# EAGLE design C64_Userport_Test (EAGLE 9.6.2)
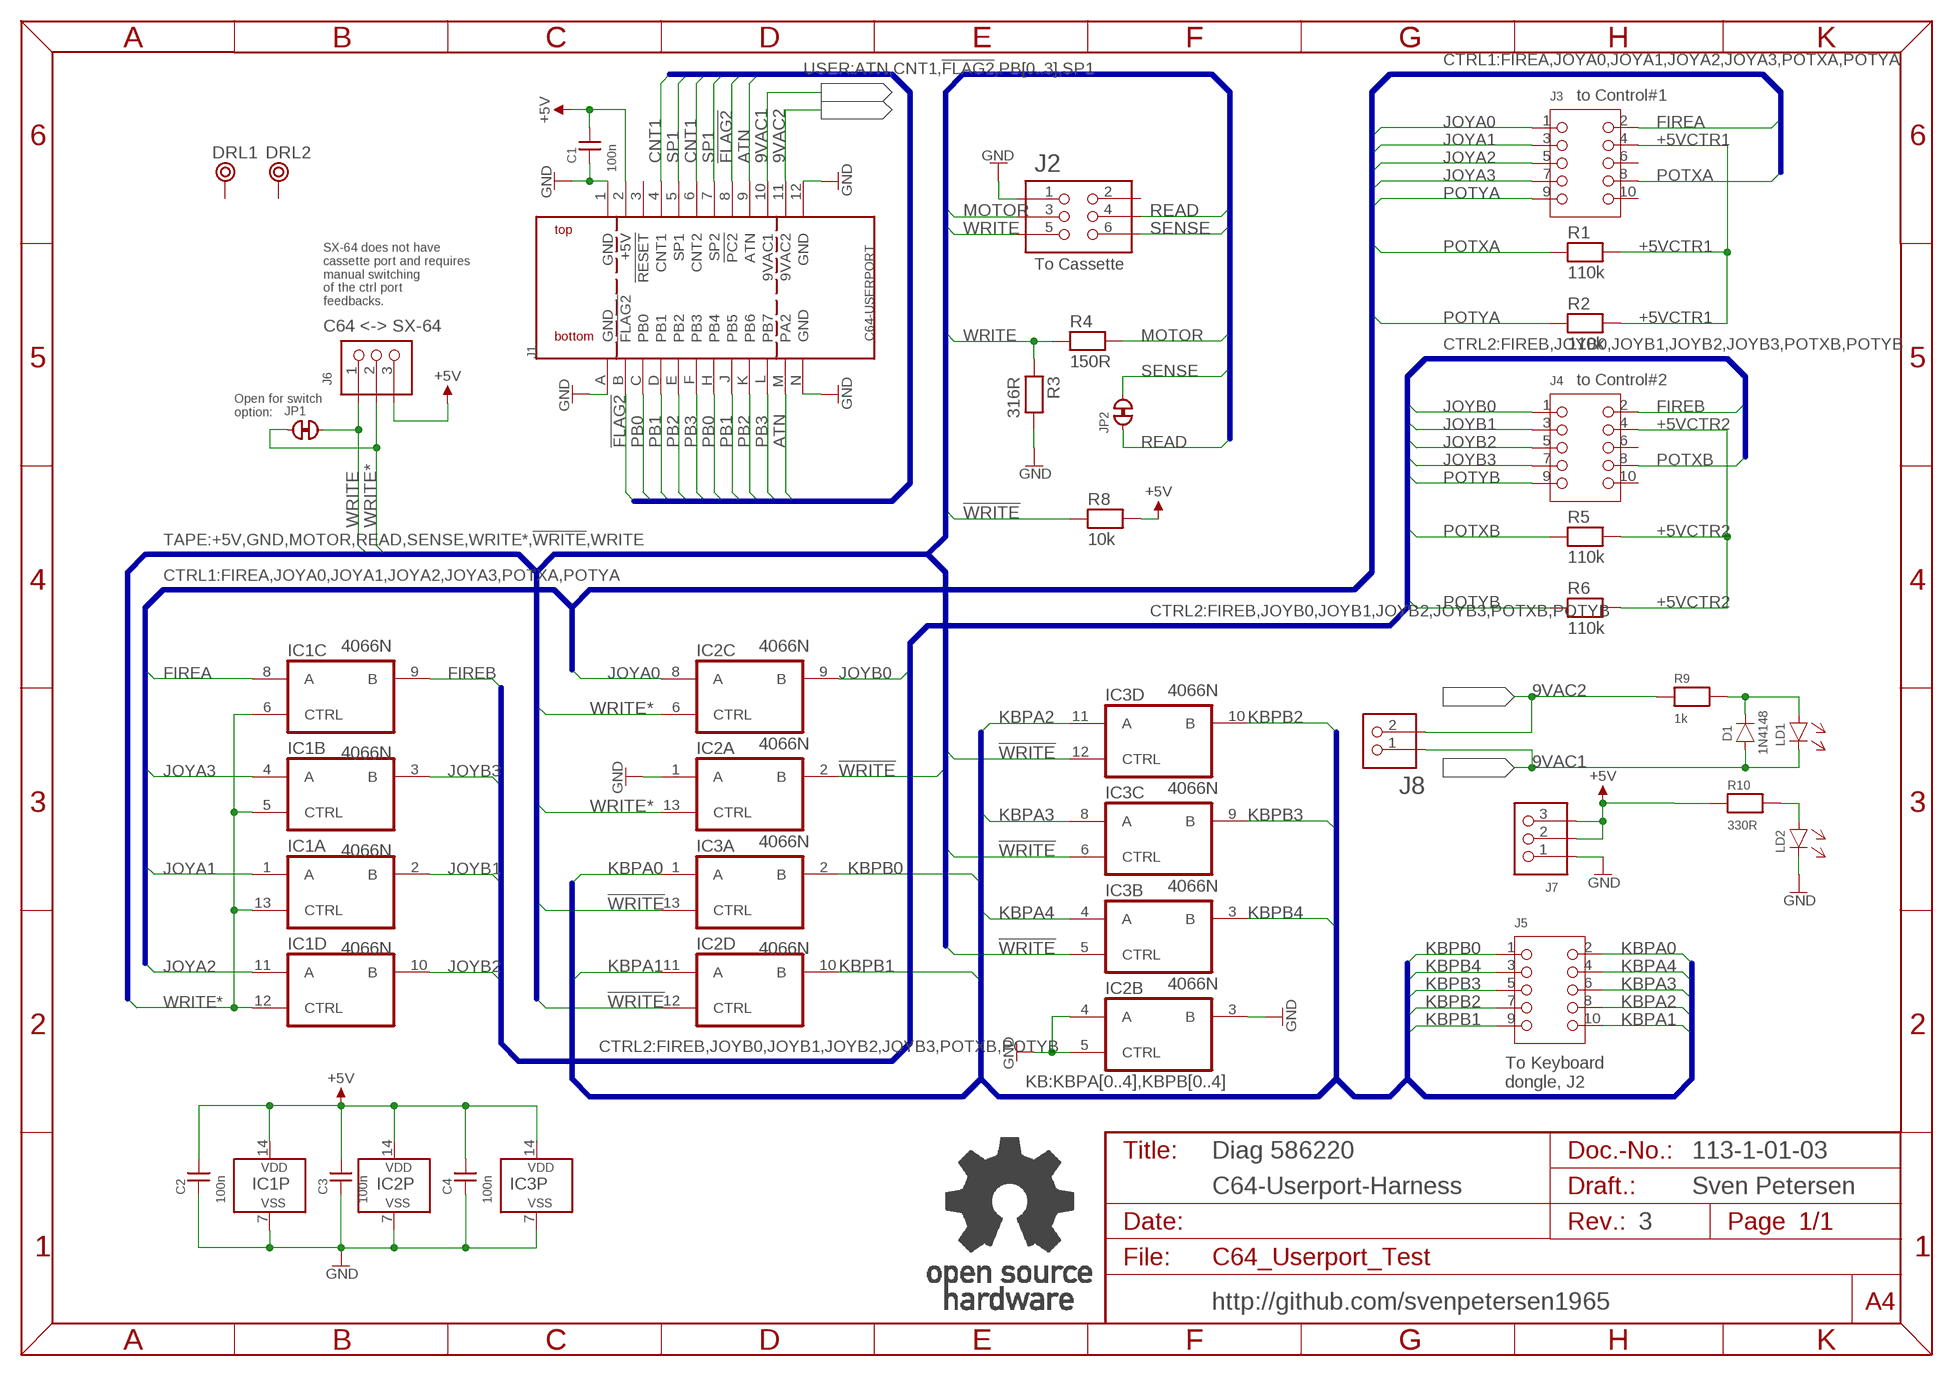
[diagram p0: schematic, sheet 1]

## Parts
C1  100n  CAP01  [C-2,5]
C2  100n  CAP01  [C-2,5]
C3  100n  CAP01  [C-2,5]
C4  100n  CAP01  [C-2,5]
D1  1N4148  [DO-35]
DRL1  BOHR3,2  [BOHR3,2]
DRL2  BOHR3,2  [BOHR3,2]
IC1  4066N  [DIL14]
IC2  4066N  [DIL14]
IC3  4066N  [DIL14]
J1  C64-USERPORT  [USERPORT]
J2  2X03WV  [2X03WV]
J3  2X05WV  [2X05WV]
J4  2X05WV  [2X05WV]
J5  2X05WV  [2X05WV]
J6  PINHD-1X3  [1X03]
J7  PINHD-1X3  [1X03]
J8  PINHD-1X2  [1X02]
JP1  CLOSED  [CP_CL]
JP2  CLOSED  [CP_CL]
LD1  3MM  [3MM]
LD2  3MM  [3MM]
R1  110k  RES04  [R-10]
R2  110k  RES04  [R-10]
R3  316R  RES04  [R-10]
R4  150R  RES04  [R-10]
R5  110k  RES04  [R-10]
R6  110k  RES04  [R-10]
R8  10k  RES04  [R-10]
R9  1k  RES04  [R-10]
R10  330R  RES04  [R-10]
U$20  OPEN_SOURCE_HW  [OPENHW]

## Nets
9VAC1: D1.A J1.10(9VAC1) J8.1 LD1.C(K)
9VAC2: J1.11(9VAC2) J8.2 R9.1
!FLAG2: J1.8(!PC2) J1.B(!FLAG2)
!WRITE: IC2.2(A:B) IC2.12(D:CTRL) IC3.5(B:CTRL) IC3.6(C:CTRL) IC3.12(D:CTRL) IC3.13(A:CTRL) R8.1
+5V: C1.2 C2.2 C3.2 C4.2 IC1.14(P:VDD) IC2.14(P:VDD) IC3.14(P:VDD) J1.2(+5V) J6.3 J7.2 J7.3 R8.2 R10.1
+5VCTR1: J3.4 R1.2 R2.2
+5VCTR2: J4.4 R5.2 R6.2
ATN: J1.9(ATN) J1.M(PA2)
CNT1: J1.4(CNT1) J1.6(CNT2)
FIREA: IC1.8(C:A) J3.2
FIREB: IC1.9(C:B) J4.2
GND: C1.1 C2.1 C3.1 C4.1 IC1.7(P:VSS) IC2.1(A:A) IC2.3(B:B) IC2.4(B:A) IC2.5(B:CTRL) IC2.7(P:VSS) IC3.7(P:VSS) J1.1(GND) J1.12(GND) J1.A(GND) J1.N(GND) J2.1 J7.1 LD2.C(K) R3.2
JOYA0: IC2.8(C:A) J3.1
JOYA1: IC1.1(A:A) J3.3
JOYA2: IC1.11(D:A) J3.5
JOYA3: IC1.4(B:A) J3.7
JOYB0: IC2.9(C:B) J4.1
JOYB1: IC1.2(A:B) J4.3
JOYB2: IC1.10(D:B) J4.5
JOYB3: IC1.3(B:B) J4.7
KBPA0: IC3.1(A:A) J5.2
KBPA1: IC2.11(D:A) J5.10
KBPA2: IC3.11(D:A) J5.8
KBPA3: IC3.8(C:A) J5.6
KBPA4: IC3.4(B:A) J5.4
KBPB0: IC3.2(A:B) J5.1
KBPB1: IC2.10(D:B) J5.9
KBPB2: IC3.10(D:B) J5.7
KBPB3: IC3.9(C:B) J5.5
KBPB4: IC3.3(B:B) J5.3
MOTOR: J2.3 R4.2
N$1: D1.K LD1.A R9.2
N$3: LD2.A R10.2
PB0: J1.C(PB0) J1.H(PB4)
PB1: J1.D(PB1) J1.J(PB5)
PB2: J1.E(PB2) J1.K(PB6)
PB3: J1.F(PB3) J1.L(PB7)
POTXA: J3.8 R1.1
POTXB: J4.8 R5.1
POTYA: J3.9 R2.1
POTYB: J4.9 R6.1
READ: J2.4 JP2.1
SENSE: J2.6 JP2.2
SP1: J1.5(SP1) J1.7(SP2)
WRITE: J2.5 J6.1 JP1.2 R3.1 R4.1
WRITE*: IC1.5(B:CTRL) IC1.6(C:CTRL) IC1.12(D:CTRL) IC1.13(A:CTRL) IC2.6(C:CTRL) IC2.13(A:CTRL) J6.2 JP1.1
Unconnected: DRL1.P$1 DRL2.P$1 J1.3(!RESET) J2.2 J3.6 J3.10 J4.6 J4.10

## Buses
USER:ATN,CNT1,!FLAG2,PB[0..3],SP1
TAPE:+5V,GND,MOTOR,READ,SENSE,WRITE*,!WRITE,WRITE
CTRL1:FIREA,JOYA0,JOYA1,JOYA2,JOYA3,POTXA,POTYA
CTRL2:FIREB,JOYB0,JOYB1,JOYB2,JOYB3,POTXB,POTYB
KB:KBPA[0..4],KBPB[0..4]

## Notes on the sheet
- to Control#1
- To Cassette
- SX-64 does not have
  cassette port and requires
  manual switching
  of the ctrl port
  feedbacks.
- C64 <-> SX-64
- to Control#2
- Open for switch
  option:
- To Keyboard
  dongle, J2
- Diag 586220 | 113-1-01-03
- C64-Userport-Harness | Sven Petersen
- 3
- http://github.com/svenpetersen1965

## Library data of the parts
C1-C4 = DISCRETE:CAP01
D1 = Dioden:1N4148
DRL1 DRL2 = Mech_Bohr:BOHR3,2
IC1-IC3 = 40xx:4066: Quad bilateral ANALOG SWITCH
J1 = Commodore:C64-USERPORT
J2 = PINHEAD:2X03WV
J3-J5 = PINHEAD:2X05WV
J6 J7 = PINHEAD:PINHD-1X3
J8 = PINHEAD:PINHD-1X2
JP1 JP2 = Cutpad:CLOSED: Closed Cutpad
LD1 LD2 = LED:3MM
R1-R6 R8-R10 = DISCRETE:RES04
U$20 = Logo:OPEN_SOURCE_HW

## Board
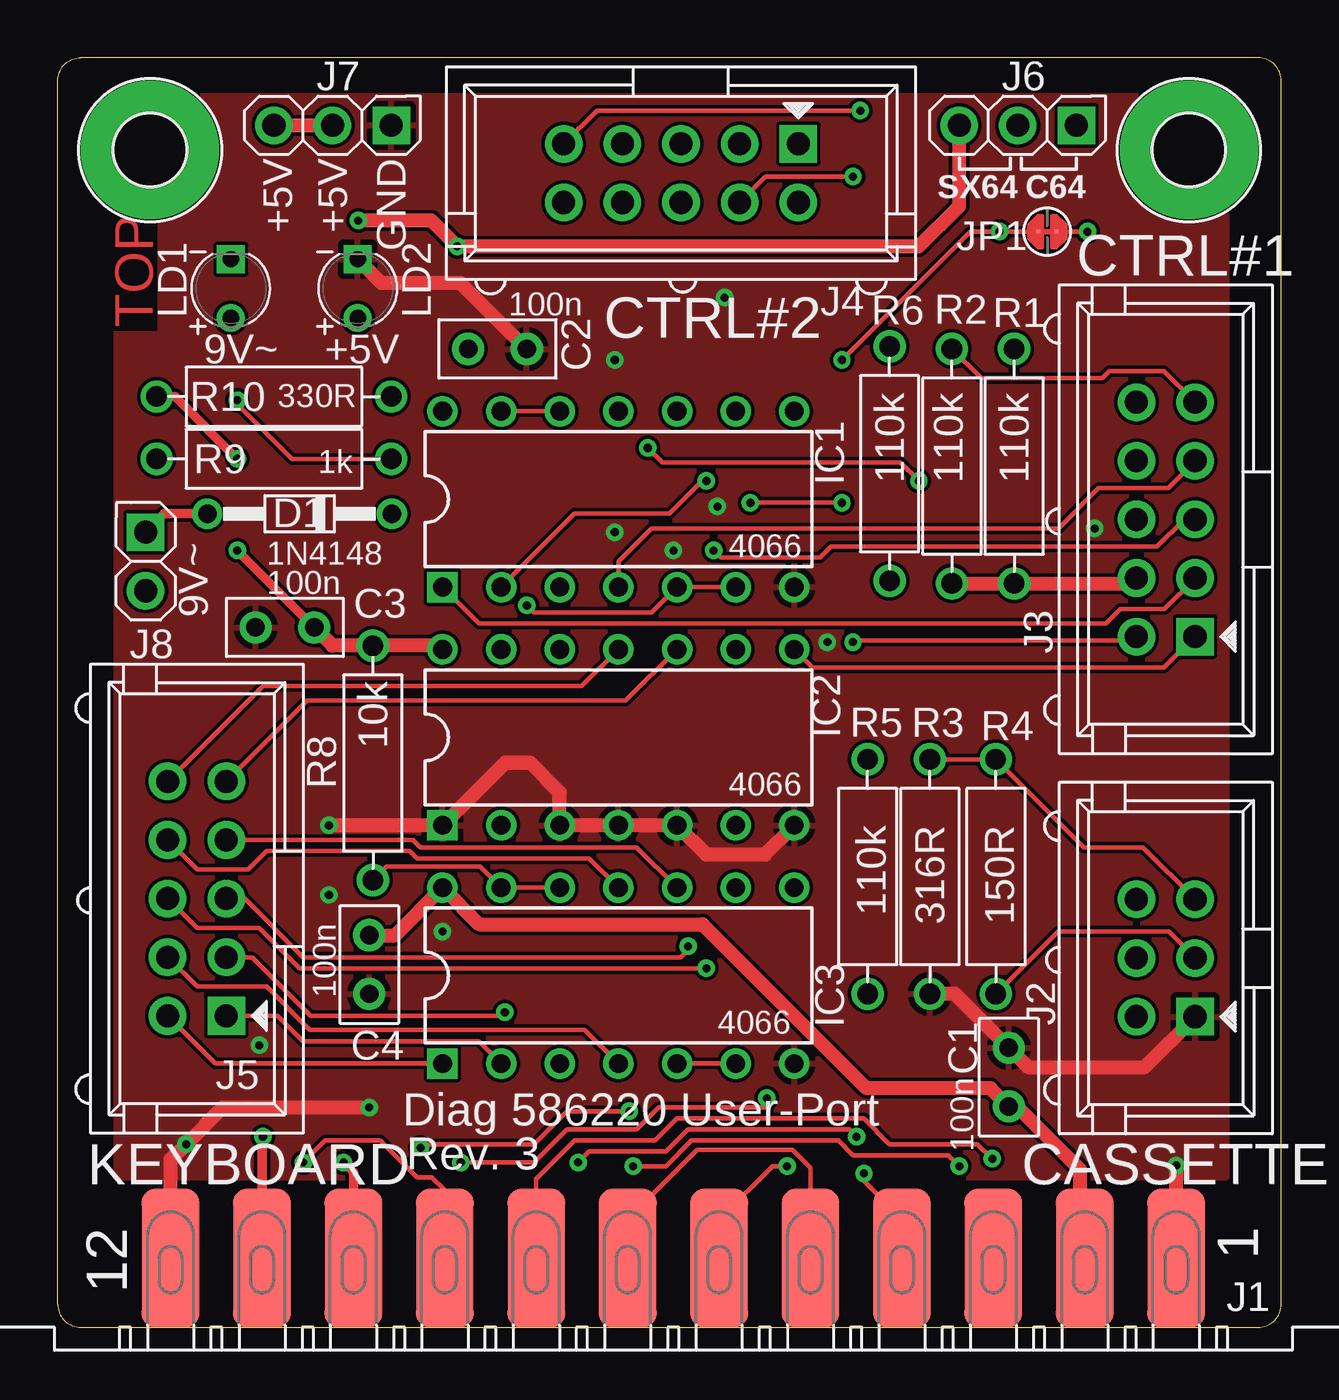
[diagram p1: board, top side]
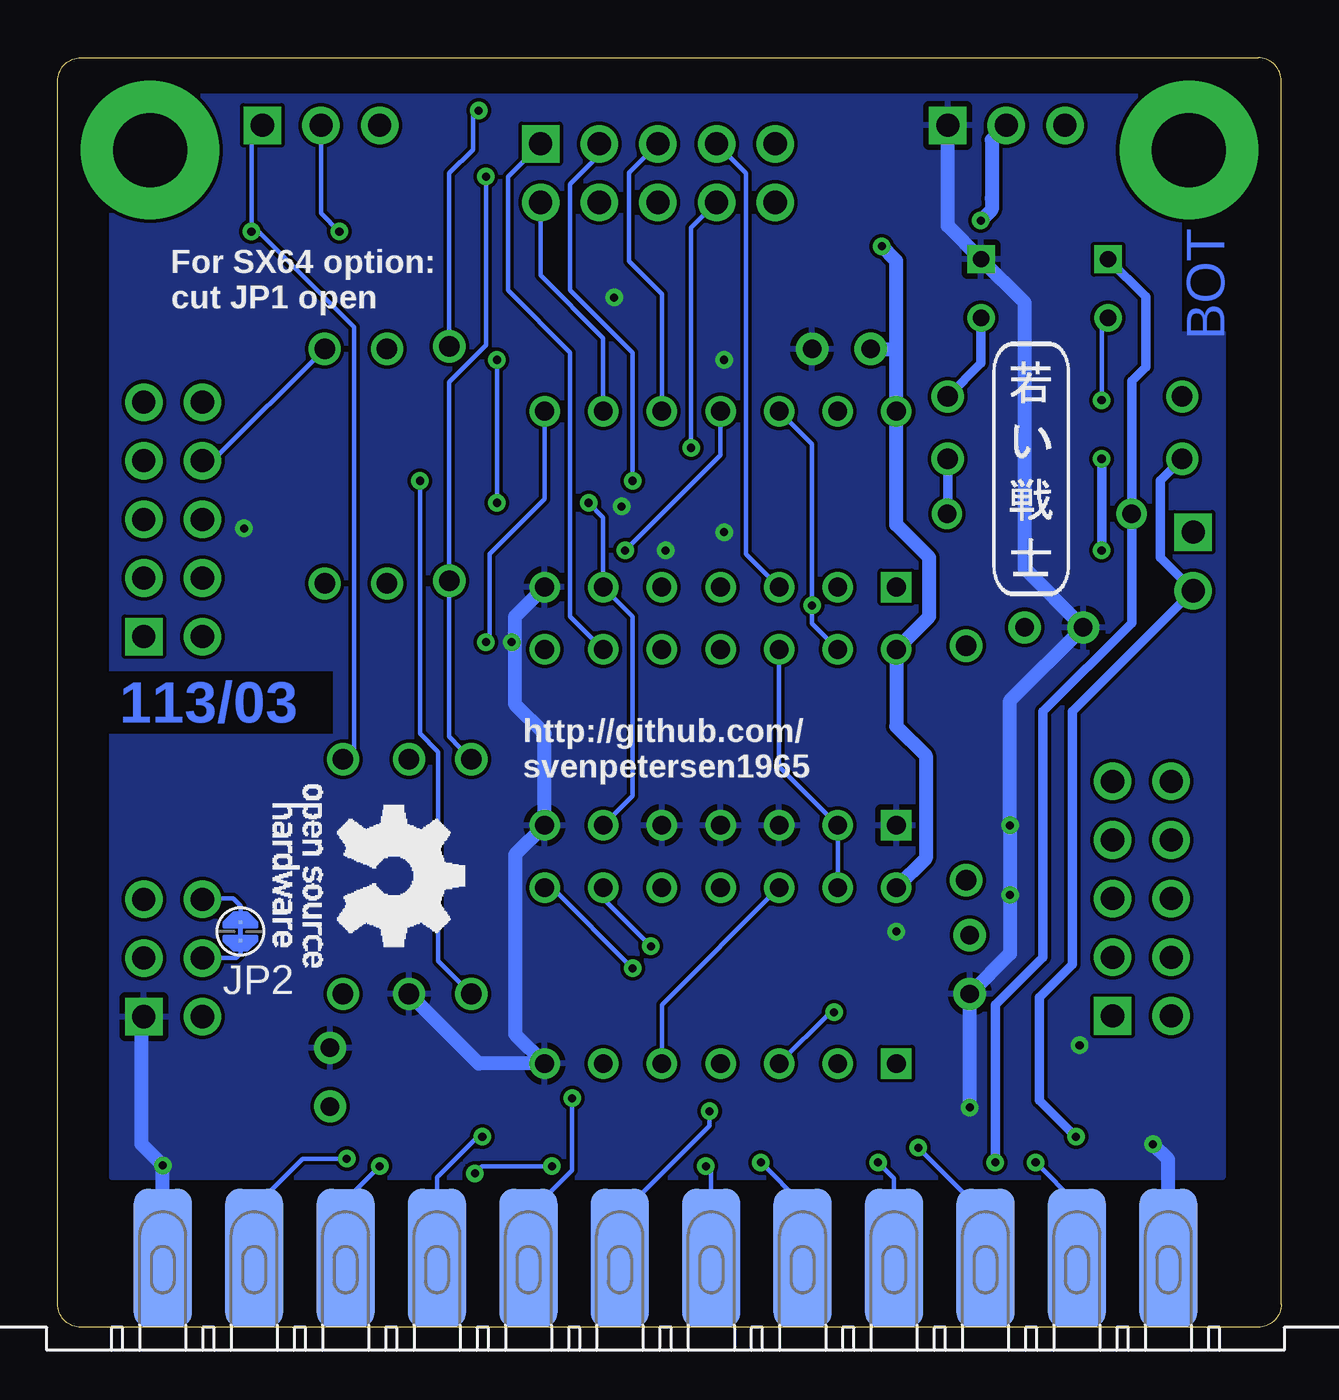
[diagram p2: board, bottom side, seen from below]

Size 53 x 55 mm. Coordinates in mm from the lower left corner, seen from the top.
Outline: 0,1 0,54 arc-90 1,55 52,55 arc-90 53,54 53,1 arc-90 52,0 1,0 arc-90 0,1
Copper layers (1*16): Top 0.035mm / dielectric 1.5mm / Bottom 0.035mm
Design rules "default *": minimum track width 6mil, minimum drill 0.35mm, track to track 6mil, track to pad 6mil, pad to pad 6mil, via to via 6mil, smd to smd 6mil, copper to edge 40mil, drill to drill 6mil, minimum pad ring 10mil, minimum via ring 8mil, stop-mask expansion 4mil, vias tented up to drill 24mil, thermal gap 10mil
bRestrict: 3 lines

### Footprints (pad centres in the part's own frame; a part is rotated, then mirrored left to right if it is on the bottom)
C-2,5 = drill 0.8 pad 1.397: 1 -1.27,0; 2 1.27,0
DO-35 = drill 0.8: A -4,0; K 4,0
BOHR3,2 = drill 3.2 pad 6: P$1 0,0
DIL14 = drill 0.813 square: 1 -7.62,-3.81 | drill 0.813: 2 -5.08,-3.81; 3 -2.54,-3.81; 4 0,-3.81; 5 2.54,-3.81; 6 5.08,-3.81; 7 7.62,-3.81; 8 7.62,3.81; 9 5.08,3.81; 10 2.54,3.81; 11 0,3.81; 12 -2.54,3.81; 13 -5.08,3.81; 14 -7.62,3.81
USERPORT = smd 2.5 x 6: 1 -21.78,-3; 2 -17.82,-3; 3 -13.86,-3; 4 -9.9,-3; 5 -5.94,-3; 6 -1.98,-3; 7 1.98,-3; 8 5.94,-3; 9 9.9,-3; 10 13.86,-3; 11 17.82,-3; 12 21.78,-3 | smd 2.5 x 6 bottom: A -21.78,-3; B -17.82,-3; C -13.86,-3; D -9.9,-3; E -5.94,-3; F -1.98,-3; H 1.98,-3; J 5.94,-3; K 9.9,-3; L 13.86,-3; M 17.82,-3; N 21.78,-3
2X03WV = drill 1 pad 1.626 square: 1 -2.54,-1.27 | drill 1 pad 1.626: 2 -2.54,1.27; 3 0,-1.27; 4 0,1.27; 5 2.54,-1.27; 6 2.54,1.27
2X05WV = drill 1 pad 1.626 square: 1 -5.08,-1.27 | drill 1 pad 1.626: 2 -5.08,1.27; 3 -2.54,-1.27; 4 -2.54,1.27; 5 0,-1.27; 6 0,1.27; 7 2.54,-1.27; 8 2.54,1.27; 9 5.08,-1.27; 10 5.08,1.27
1X03 = drill 1 pad 1.626 square: 1 -2.54,0 | drill 1 pad 1.626: 2 0,0; 3 2.54,0
1X02 = drill 1 pad 1.626 square: 1 -1.27,0 | drill 1 pad 1.626: 2 1.27,0
CP_CL = smd 0.152 x 0.152: 1 -0.4,0; 2 0.4,0
3MM = drill 0.7: A -1.27,0 | drill 0.7 square: C 1.27,0
R-10 = drill 0.889 pad 1.397: 1 -5.08,0; 2 5.08,0

### Placement (x,y rotation side)
C1  41.2,10.84 270 top
C2  19.05,42.39 180 top
C3  9.84,30.32 0 top
C4  13.49,15.72 90 top
D1  10.48,35.24 0 top
DRL1  4,51 0 top
DRL2  49,51 0 top
IC1  24.29,35.88 0 top
IC2  24.29,25.56 0 top
IC3  24.29,15.24 0 top
J1  26.67,0 180 top
J2  48,16 90 top
J3  48,35 90 top
J4  27,50 180 top
J5  6.03,18.57 90 top
J6  41.59,52.07 180 top
J7  11.91,52.07 180 top
J8  3.81,33.18 270 top
JP1  42.86,47.47 0 top
JP2  45.09,17.14 90 bottom
LD1  7.5,45 90 top
LD2  13,45 90 top
R1  41.43,37.31 270 top
R2  38.73,37.31 270 top
R3  37.78,19.53 270 top
R4  40.64,19.53 270 top
R5  35.08,19.53 90 top
R6  36.04,37.42 270 top
R8  13.65,24.45 90 top
R9  9.37,37.62 0 top
R10  9.37,40.32 0 top
U$15  [SVEN_TAG]  10.79,37.31 0 bottom
U$17  [2LAYER]  4.13,43.34 90 top
U$18  [PCB-TITLE/]  -0.16,68.92 0 top  (outside the outline)
U$20  43.66,23.5 270 bottom

### Tracks (layer width: path | path; a pad name or v marks a point on that pad's centre or on a via)
9VAC1  (via drill 0.35)
  Top 0.406: J1.10 12.81,6.72 v12.38,7.14 | J8.1 4.6,35.24 D1.A
  Bottom 0.406: v12.38,7.14 12.38,13.97 10.32,16.03 10.32,26.67 6.48,30.51 D1.A 6.48,40.99 5.87,41.59 5.87,44.64 LD1.C
9VAC2  (via drill 0.35)
  Top 0.406: J1.11 8.85,8.21 v8.89,8.26
  Bottom 0.406: v8.89,8.26 10.48,9.84 10.48,14.29 9.05,15.72 9.05,26.67 J8.2 5.24,33.34 5.24,36.67 R9.1
!FLAG2  (via drill 0.35)
  Top 0.203: J1.8 20.73,6.44 22.38,8.1 25.88,8.1 26.83,9.05 34.92,9.05 36.04,7.94 39.85,7.94 v40.48,7.3
  Bottom 0.203: v40.48,7.3 42.39,7.3 44.49,5.2 J1.B
!WRITE
  Top 0.203: IC3.5 IC3.6 | IC3.12 IC3.13 18.29,19.96 14.25,19.96 R8.1
  Bottom 0.203: IC3.12 26.83,13.97 IC3.5 | IC2.12 21.75,24.29 IC2.2 IC3.13
+5V  (via drill 0.35)
  Top 0.406: C3.2 v7.78,33.66 | v7.78,37.62 5.08,40.32 R10.1
  Top 0.61: C4.2 14.61,16.99 IC3.14 18.26,17.46 27.94,17.46 35.04,10.36 40.41,10.36 C1.2 41.55,9.57 44.29,6.83 44.29,3.2 J1.2 | C3.2 11.91,29.53 R8.2 16.51,29.53 IC2.14 | J6.3 39.05,48.58 37.31,46.83 36.83,46.83 v17.3,46.83 16.19,47.94 v13.02,47.94 | J7.3 J7.2
  Bottom 0.406: v7.78,33.66 v7.78,37.62
  Bottom 0.61: IC3.14 15.4,20.32 15.4,24.77 16.67,26.04 IC2.14 15.24,30.8 15.24,33.34 16.67,34.77 IC1.14 16.67,42.23 | 16.67,42.23 16.67,46.2 v17.3,46.83 | C2.2 16.83,42.39 16.67,42.23 | v13.02,47.94 12.54,48.42 12.54,48.9 12.54,51.44 J7.2
+5VCTR1
  Top 0.61: R2.2 R1.2 46.5,32.23 J3.4
+5VCTR2  (via drill 0.35)
  Top 0.203: J4.4 30.66,49.85 v34.45,49.85
  Bottom 0.203: R5.2 36.04,25.61 R6.2 36.04,40.96 34.45,42.55 v34.45,49.85
ATN  (via drill 0.35)
  Top 0.203: J1.9 16.77,5.93 16.19,6.51 15.56,6.51 13.97,8.1 13.02,8.1 11.59,8.1 v10.64,7.14
  Bottom 0.203: J1.M 8.85,5.36 v10.64,7.14
CNT1  (via drill 0.35)
  Top 0.203: J1.6 28.73,3.08 28.73,4.76 30.96,6.99 v31.59,6.99 | v34.92,6.67 34.92,6.35 36.57,4.71 J1.4
  Bottom 0.203: v31.59,6.99 34.61,6.99 v34.92,6.67
FIREA  (via drill 0.35)
  Top 0.203: J3.2 46.57,29.76 34.52,29.76 v34.45,29.69
  Bottom 0.203: v34.45,29.69 34.29,29.84 34.29,33.5 31.91,35.88 IC1.8
FIREB
  Bottom 0.203: IC1.9 29.37,42.86 32.08,45.57 J4.2
GND  (via drill 0.35)
  Top 0.61: v13.49,9.53 7.14,9.53 v5.56,7.94 4.89,7.27 J1.12 | R3.2 38.87,14.45 C1.1 42.04,11.27 47.08,11.27 J2.1 | v11.75,21.75 IC2.1 19.37,24.45 20.47,24.45 21.75,23.18 IC2.3 IC2.4 IC2.5 28.1,20.48 30.64,20.48 IC2.7 | J1.A 48.45,6.95 48.42,6.99 v48.45,7.02 | C2.1 17.46,45.24 14.03,45.24 LD2.C
  Bottom 0.61: J1.12 4.89,7.27 v5.56,7.94 | v13.49,9.53 C4.1 11.75,16.19 v11.75,21.75 11.75,27.15 C3.1 11.11,32.86 11.11,44.38 LD2.C 14.45,47.72 J7.1 | R3.2 34.77,11.43 IC3.7 33.18,12.7 33.18,20.48 IC2.7 31.91,25.72 33.18,26.99 33.18,30.8 IC1.7 | J1.A v48.45,7.02 49.37,7.94 49.37,13.36 J2.1
  other vias: 11.75,18.73 16.67,17.14 8.73,12.22 26.67,33.66 24.13,34.45 33.34,29.69 44.93,34.61 24.13,41.91 28.89,44.61 28.57,35.56
  pour Top: 2.54,6.51 50.64,6.51 50.64,53.34 2.54,53.34
  pour Bottom: 2.54,6.51 50.64,6.51 50.64,53.34 2.54,53.34
JOYA0
  Top 0.203: J3.1 47.92,28.57 32.7,28.57 IC2.8
JOYA1
  Top 0.203: J3.3 49.27,32.44 47.94,31.11 46.04,31.11 45.4,30.48 35.56,30.48 18.26,30.48 IC1.1
JOYA2  (via drill 0.35)
  Top 0.203: J3.5 48.79,35 47.61,33.81 33.5,33.81 33.02,33.34 28.73,33.34 v28.42,33.66
  Bottom 0.203: v28.42,33.66 24.29,37.78 IC1.11
JOYA3
  Top 0.203: IC1.4 24.29,33.18 25.72,34.61 43.34,34.61 45.09,36.35 48.1,36.35 49.27,37.52 J3.7
JOYB0
  Bottom 0.203: IC2.9 30.8,30.8 30.8,42.23 33.5,44.93 33.5,49.85 J4.1
JOYB1  (via drill 0.35)
  Top 0.203: v28.1,36.67 27.94,36.67 26.51,35.24 22.38,35.24 IC1.2
  Bottom 0.203: J4.3 29.54,50.79 30.8,49.53 30.8,44.93 28.1,42.23 v28.1,36.67
JOYB2
  Bottom 0.203: IC1.10 26.83,44.77 28.26,46.2 28.26,50.01 J4.5
JOYB3
  Bottom 0.203: J4.7 23.18,49.99 23.18,33.5 IC1.3
KBPA0
  Top 0.203: J5.2 6.83,11.43 IC3.1
KBPA1
  Top 0.203: J5.10 8.89,27.78 22.7,27.78 IC2.11
KBPA2
  Top 0.203: J5.8 6.03,19.84 8.26,19.84 9.05,20.64 15.24,20.64 15.56,20.32 18.26,20.32 23.02,20.32 IC3.11
KBPA3  (via drill 0.35)
  Top 0.203: J5.6 6.03,17.3 8.73,17.3 10.48,15.56 v28.1,15.56
  Bottom 0.203: IC3.8 31.59,19.05 v28.1,15.56
KBPA4
  Top 0.203: J5.4 6.03,14.76 9.05,14.76 10.92,12.9 22.82,12.9 IC3.4
KBPB0
  Top 0.203: J5.1 9.53,13.49 10.64,12.38 18.26,12.38 IC3.2
KBPB1
  Top 0.203: J5.9 10.79,27.15 24.61,27.15 IC2.10
KBPB2
  Top 0.203: J5.7 15.4,21.11 15.72,20.8 25.08,20.8 IC3.10
KBPB3  (via drill 0.35)
  Top 0.203: J5.5 8.1,18.57 10.64,16.03 26.99,16.03 27.3,16.35 v27.3,16.51
  Bottom 0.203: v27.3,16.51 29.37,18.57 IC3.9
KBPB4  (via drill 0.35)
  Top 0.203: J5.3 8.41,16.03 10.95,13.49 19.21,13.49 v19.37,13.65
  Bottom 0.203: v19.37,13.65 19.53,13.65 IC3.3
MOTOR
  Top 0.203: J2.3 48.12,17.14 43.34,17.14 41.67,15.48 R4.2
N$1  (via drill 0.35)
  Top 0.203: R9.2 10.16,37.62 7.78,40.01 v7.78,40.16
  Bottom 0.203: LD1.A 7.78,43.45 v7.78,40.16
  Bottom 0.406: D1.K 14.45,35.27 R9.2
N$3
  Bottom 0.406: R10.2 13,41.77 LD2.A
PB0  (via drill 0.35)
  Top 0.203: v24.92,6.99 26.35,6.99 27.46,8.1 33.81,8.1 34.45,7.46 38.58,7.46 v39.05,6.99
  Bottom 0.203: J1.H 24.69,6.75 v24.92,6.99 | v39.05,6.99 40.53,5.51 J1.C
PB1  (via drill 0.35)
  Top 0.203: v22.54,7.14 23.02,7.62 26.35,7.62 27.3,8.57 34.29,8.57 v34.61,8.26
  Bottom 0.203: J1.J 20.73,5.33 v22.54,7.14 | v34.61,8.26 34.81,8.26 36.57,6.49 J1.D
PB2  (via drill 0.35)
  Top 0.203: v30.72,9.92 30.72,9.53 26.04,9.53 25.08,8.57 22.07,8.57 20.64,7.14 v17.46,7.14
  Bottom 0.203: J1.K 16.77,6.45 v17.46,7.14 | v30.72,9.92 30.72,6.8 32.28,5.24 32.54,5.24 32.61,5.17 J1.E
PB3  (via drill 0.35)
  Top 0.203: v24.77,9.37 22.07,9.37 20.64,7.94 15.88,7.94 v15.72,7.78
  Bottom 0.203: J1.L 12.81,4.87 v15.72,7.78 | J1.F 28.65,4.85 24.77,8.73 v24.77,9.37
POTXA
  Bottom 0.203: J3.8 46.28,37.54 R1.1
POTXB  (via drill 0.35)
  Top 0.203: v25.56,38.1 26.19,37.47 36.51,37.47 v37.31,36.67
  Bottom 0.203: J4.8 25.56,47.63 v25.56,38.1 | v37.31,36.67 37.31,25.72 36.51,24.92 36.51,15.88 R5.1
POTYA
  Top 0.203: R2.1 40.01,41.12 45.24,41.12 45.56,41.43 47.92,41.43 J3.9
POTYB  (via drill 0.35)
  Top 0.203: J4.9 23.36,52.7 v34.77,52.7
  Bottom 0.203: v34.77,52.7 35.01,52.46 35.01,51.02 36.04,50 R6.1
READ
  Bottom 0.203: JP2.1 45.09,16.19 45.28,16 J2.4
SENSE
  Bottom 0.203: JP2.2 45.09,18.26 45.4,18.57 46.7,18.57 J2.6
SP1
  Top 0.203: J1.7 24.69,4.69 27.7,7.7 31.83,7.7 32.61,6.92 J1.5
WRITE  (via drill 0.35)
  Top 0.203: J2.5 47.01,20.8 44.45,20.8 R4.1 R3.1 | JP1.2 v44.61,47.47
  Bottom 0.203: R4.1 40.16,25.08 40.16,43.34 40.8,43.97 42.86,46.04 44.29,47.47 v44.61,47.47 44.61,51.59 J6.1
WRITE*  (via drill 0.35)
  Top 0.203: IC1.13 IC1.12 | v20.32,31.27 20.64,30.96 25.72,30.96 IC1.5 IC1.6 | v30,35.72 32.07,35.72 v33.97,35.72 | v33.97,41.91 38.73,46.67 39.53,47.47 v40.8,47.47 JP1.1
  Bottom 0.203: IC2.6 28.1,23.02 28.1,30.8 IC1.6 29.37,35.08 v30,35.72 | IC2.13 20.32,30.48 v20.32,31.27 20.32,38.26 IC1.12 | v33.97,35.72 v33.97,41.91 | J6.2 41.59,48.48 41.59,48.26 v40.8,47.47

### Text on the board
Bottom: 113/03
tPlace: +5V | +5V | GND | SX64 | C64 | CTRL#1 | CTRL#2 | 9V~ | +5V | 330R | 1k | 1N4148 | 9V~ | Diag 586220 User-Port | Rev. 3 | KEYBOARD | CASSETTE | 1 | 12
bPlace: For SX64 option: / cut JP1 open | http://github.com/ / svenpetersen1965
tNames: 100n | 110k | 110k | 110k | 4066 | 100n | 10k | 4066 | 110k | 316R | 150R | 100n | 4066 | 100n
Document: 113-2-01-03 | Sven Peterssen / 2022 | 35µm | 2 | 3